# EasyEDA Pro project OV-Watch_V2.4_LCProject_2024-05-25.epro, board Back
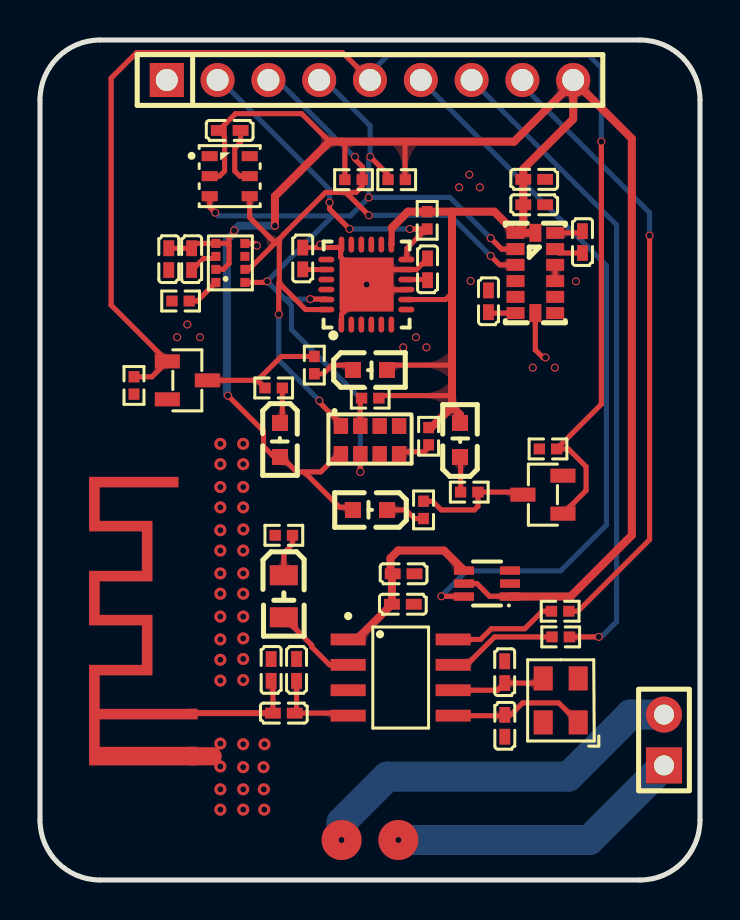
[diagram p6: board, top side]
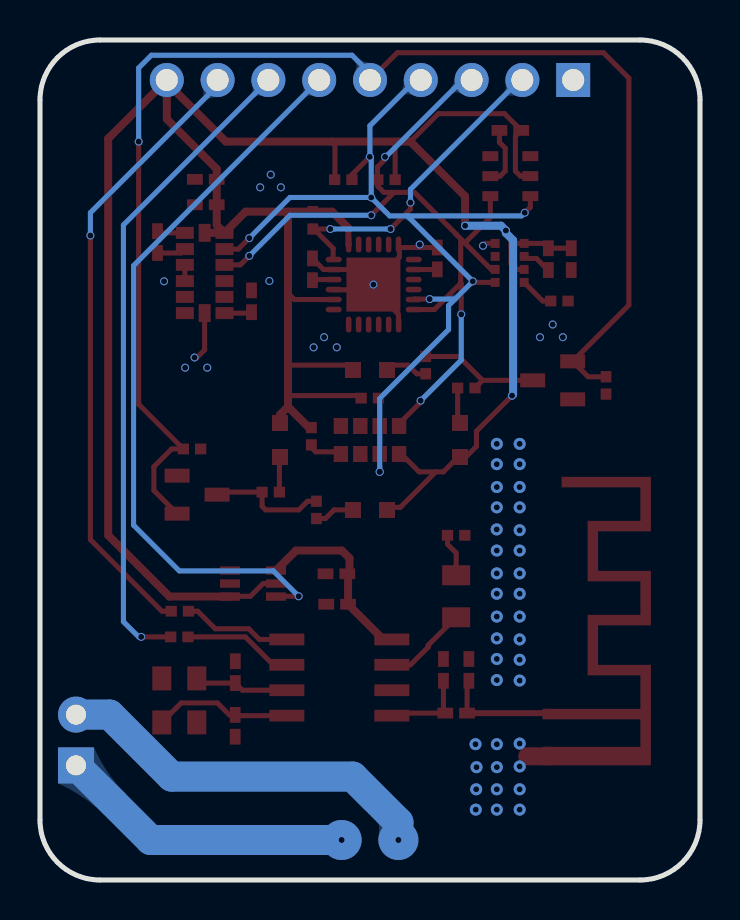
[diagram p7: board, bottom side, seen from below]

Outline 33 x 42 mm; copper layers: Top Layer, Bottom Layer. Coordinates in mm from the lower left corner of the outline.
Outline path: 0,39 0,3 arc(0.88,0.88) 3,0 30,0 arc(32.12,0.88) 33,3 33,39 arc(32.12,41.12) 30,42 3,42 arc(0.88,41.12) 0,39
Stack: Top Layer 0.035mm / Dielectric1 1.51mm FR4 er 4.5 / Bottom Layer 0.035mm

## Design rules (mm)
template: 用户自定义配置
spacing safeClearance (default): track to track 0.152, other pairs 0.152 to 0.3
track width trackWidth (default): min 0.127, default 0.254, max 2.54
differential pair differentialPair (default): width min 0.127, default 0.254, max 2.54; gap min 0.152, default 0.152
via viaSize (default): diameter min 0.4, default 0.4, max 10; hole min 0.3, default 0.3, max 6

## Placement (name value [footprint] x y rotation side)
C1  100nF  [C0402]  18.18 15.31 180 top
C2  10uF  [C0402]  18.14 13.79 180 top
C21  100nF  [C0402]  19.38 30.53 90 top
C22  2.2nF  [C0402]  13.14 31.08 90 top
C23  100nF  [C0402]  7.58 31.04 270 top
C24  100nF  [C0402]  6.44 31.04 270 top
C27  0.22uF  [C0402]  27.12 31.89 90 top
C28  4.7uF  [C0402]  22.42 28.94 270 top
C29  100nF  [C0402]  24.71 33.76 180 top
C30  10uF  [C0402]  24.71 35.03 180 top
C31  10uF  [C0402]  9.48 37.48 180 top
C37  NC  [C0402]  11.56 10.5 90 top
C39  2.7pF  [C0402]  12.19 8.34 0 top
C40  NC  [C0402]  23.24 7.71 270 top
C41  NC  [C0402]  23.23 10.39 90 top
H1  外接焊盘  [HDR-TH_2P-P2.54-V-M-1]  31.2 7 90 top
H2  -  [HDR-TH_9P-P2.54-V-M]  16.5 40 0 top
KT6328A1  -  [KT6328A-SOP8]  18.03 10.12 270 top
L1  NC  [L0402]  12.83 10.5 90 top
LED1  SZYY0805R  [LED0805-R-RD]  12.19 14.19 270 top
LED2  ORH-G36G  [LED0603-R-RD]  12 22 270 top
LED3  ORH-G36G  [LED0603-R-RD]  16.5 25.5 0 top
LED4  ORH-G36G  [LED0603-R-RD]  16.5 18.5 180 top
LED5  ORH-G36G  [LED0603-R-RD]  21 22 90 top
R1  4.7kΩ  [R0402]  15.68 35.02 180 top
R2  4.7kΩ  [R0402]  17.84 35.02 0 top
R3  10K  [R0402]  16.51 24.09 0 top
R4  4.7kΩ  [R0402]  19.36 32.98 270 top
R18  10K  [R0402]  12.19 17.23 180 top
R21  10K  [R0402]  7.03 28.95 180 top
R23  100  [R0402]  26.01 13.44 0 top
R24  100  [R0402]  26.03 12.16 0 top
R27  100  [R0402]  19.43 22.19 90 top
R28  100  [R0402]  11.68 24.6 0 top
R29  100  [R0402]  13.72 25.74 270 top
R30  100  [R0402]  19.18 18.5 270 top
R31  100  [R0402]  21.46 19.39 180 top
R32  10K  [R0402]  4.7 24.73 90 top
R33  10K  [R0402]  25.4 21.55 0 top
U1  -  [磁吸充电盘2pinX2.84]  16.5 2 0 top
U2  2N7002  [SOT-23-3_L2.9-W1.3-P1.90-LS2.4-BR]  7.37 24.98 180 top
U3  BL1551B  [SC-70-6_L2.1-W1.3-P0.65-LS2.3-BR]  22.35 14.82 0 top
U4  MPU6050-YJLTY  [QFN-24_L4.0-W4.0-P0.50-BL-EP2.7]  16.32 29.77 0 top
U5  SPL06-001  [SENSOR-SMD_SPL06-001]  9.52 30.85 90 top
U6  LSM303DLHC  [LGA-14]  24.77 30.35 270 top
U7  EM7028  [DFN-8_L4.2-W1.4-P0.95-TL]  16.5 22 0 top
U8  AHT21  [SENSOR-SMD_L3.0-W3.0-P1.00-BR]  9.48 35.19 180 top
U12  -  [通用蓝牙天线]  7.62 18.63 90 top
U13  2N7002  [SOT-23-3_L2.9-W1.3-P1.90-LS2.4-BR]  25.15 19.27 0 top
X1  24MHz  [OSC-SMD_4P-L3.2-W2.5-BL_KYOCERA_KC3225A]  26.03 8.98 90 top

## Footprints (pads in the part's own frame, mm; a bottom-side part is the same pattern mirrored in y, then rotated)
C0402
  rect 0.79x0.54 smd: 1(-0.545,0) 2(0.545,0)
DFN-8_L4.2-W1.4-P0.95-TL
  rect 0.72x0.8 smd: 1(-1.455,0.7) 2(-0.485,0.7) 3(0.485,0.7) 4(1.455,0.7) 5(1.455,-0.7) 6(0.485,-0.7) 7(-0.485,-0.7) 8(-1.455,-0.7)
HDR-TH_2P-P2.54-V-M-1
  rect 1.8x1.8 hole 1: 1(-1.27,0)
  round 1.8 hole 1: 2(1.27,0)
HDR-TH_9P-P2.54-V-M
  rect 1.7x1.7 hole 1.1: 1(-10.16,0)
  round 1.7 hole 1.1: 2(-7.62,0) 3(-5.08,0) 4(-2.54,0) 5(0,0) 6(2.54,0) 7(5.08,0) 8(7.62,0) 9(10.16,0)
KT6328A-SOP8
  rect 0.589x1.75 smd: 1(-1.905,-2.625) 2(-0.635,-2.625) 3(0.635,-2.625) 4(1.905,-2.625) 5(1.905,2.625) 6(0.635,2.625) 7(-0.635,2.625) 8(-1.905,2.625)
L0402
  rect 0.79x0.54 smd: 1(-0.545,0) 2(0.545,0)
LED0603-R-RD
  rect 0.8x0.8 smd: 1(0.851,0) 2(-0.851,0)
LED0805-R-RD
  rect 1x1.399 smd: 1(1.05,0) 2(-1.05,0)
LGA-14
  rect 0.6x0.899 smd: 1(-2.006,-0.991) 2(-1.194,-0.991) 3(-0.406,-0.991) 4(0.406,-0.991) 5(1.194,-0.991) 6(2.006,-0.991) 8(2.006,0.991) 9(1.194,0.991) 10(0.406,0.991) 11(-0.406,0.991) 12(-1.194,0.991) 13(-2.006,0.991)
  rect 0.899x0.6 smd: 7(2.006,0) 14(-2.006,0)
OSC-SMD_4P-L3.2-W2.5-BL_KYOCERA_KC3225A
  rect 1.2x0.95 smd: 1(-1.1,-0.875) 2(1.1,-0.875) 3(1.1,0.875) 4(-1.1,0.875)
QFN-24_L4.0-W4.0-P0.50-BL-EP2.7
  oval 0.28x0.8 smd: 1(-1.25,-2) 2(-0.75,-2) 3(-0.25,-2) 4(0.25,-2) 5(0.75,-2) 6(1.25,-2) 13(1.25,2) 14(0.75,2) 15(0.25,2) 16(-0.25,2) 17(-0.75,2) 18(-1.242,2)
  oval 0.8x0.28 smd: 7(2,-1.25) 8(2,-0.75) 9(2,-0.25) 10(2,0.25) 11(2,0.75) 12(2,1.25) 19(-2,1.25) 20(-2,0.75) 21(-2,0.25) 22(-2,-0.25) 23(-2,-0.75) 24(-2,-1.25)
  rect 2.7x2.7 smd: 25(0.013,0)
R0402
  rect 0.566x0.54 smd: 1(-0.433,0) 2(0.433,0)
SC-70-6_L2.1-W1.3-P0.65-LS2.3-BR
  rect 1x0.42 smd: 1(1.15,-0.65) 2(1.15,0) 3(1.15,0.65) 4(-1.15,0.65) 5(-1.15,0) 6(-1.15,-0.65)
SENSOR-SMD_L3.0-W3.0-P1.00-BR
  rect 0.8x0.5 smd: 1(1,-1) 2(1,0) 3(1,1) 4(-1,1) 5(-1,0) 6(-1,-1)
SENSOR-SMD_SPL06-001
  rect 0.45x0.45 smd: 1(0.975,-0.725) 2(0.325,-0.725) 3(-0.325,-0.725) 4(-0.975,-0.725) 5(-0.975,0.725) 6(-0.325,0.725) 7(0.325,0.725) 8(0.975,0.725)
SOT-23-3_L2.9-W1.3-P1.90-LS2.4-BR
  rect 1.25x0.7 smd: 1(1,-0.95) 2(1,0.95) 3(-1,0)
磁吸充电盘2pinX2.84
  round 2 smd: 1(-1.42,0) 2(1.42,0)
  round 2 smd far side: 1(-1.42,0) 2(1.42,0)
通用蓝牙天线
  rect 0.5x0.5 smd: 1(-10.325,0)
  rect 0.9x0.5 smd: 2(-12.425,0)

## Nets
As in the schematic.

Pads without a net: U4 2 3 4 5 6 7 14 15 16 17 19 21 22; U5 2; U6 8; U7 3 4; U8 1 6

## Via types
v1: diameter 0.6, hole 0.3, Top Layer to Bottom Layer, 36 vias
v2: diameter 0.4, hole 0.3, Top Layer to Bottom Layer, 40 vias
v3: diameter 0.5, hole 0.3, Top Layer to Bottom Layer, 2 vias

## Routing (per net, layer and track width the routed paths; a pad name or vN(x,y) marks a point on that pad's centre or on a via; arc(x,y) is an arc through that point)
3V3: length 133
  Top Layer w0.254: 13.21,20.41 14.99,18.63 15.53,18.63 ; 13.21,20.41 14.04,20.41 15.04,21.41 ; 13.21,20.41 12.83,20.41 11.94,21.3 11.94,21.21 11.65,21.21 11.18,21.68 11.18,22.44 v2(9.4,24.22) ; C24.1 C23.1 7.82,31.83 U5.8 9.34,31.83 9.45,31.71 ; U5.6 9.16,30.53 9.45,30.82 9.45,31.71 ; U3.1 23.49,14.19 22.48,14.19 21.84,14.82 U3.5 ; 20.6,25.83 20.51,25.74 17.36,25.74 ; 9.45,31.71 9.45,32.09 9.71,32.35 v2(9.71,32.47) ; U4.8 20.28,29.02 20.6,29.35 ; 20.6,24.27 20.55,24.22 16.94,24.22 ; U8.2 8.98,35.19 9.23,35.45 9.23,37.19 C31.2 9.78,38.32 13.08,38.32 14.48,36.92 ; 18.38,36.92 18.25,36.79 18.25,35.03 R2.2 ; 15.1,36.92 15.24,36.77 R1.2
  Top Layer w0.3: 17.58,32.6 17.58,31.77 U4.13
  Top Layer w0.4: 26.72,39.94 29.59,37.07 29.59,17.23 26.53,14.17 U3.1 ; 26.72,39.94 26.66,39.87 ; 26.72,39.94 H2.9 26.66,39.87 ; LED5.1 21,23.26 20.6,23.66 ; 26.66,39.87 23.71,36.92 14.48,36.92 11.75,34.19 v2(11.75,32.71) ; 26.66,39.87 26.66,38.05 24.17,35.55 C30.2 C29.2 24.17,32.75 U6.1 ; 19.43,22.62 19.56,22.62 20.6,23.66 ; 20.6,33.42 R4.1 18.4,33.42 17.58,32.6 ; 20.6,33.42 20.6,23.66 ; 20.6,33.42 22.72,33.42 U6.1 ; U6.1 U6.14
  Bottom Layer w0.4: v2(11.75,32.71) 9.95,32.71 v2(9.71,32.47) 9.71,32.35 9.34,31.99 9.34,24.27 v2(9.4,24.22)
GND: length 32.3
  Top Layer w0.254: 15.08,27.83 15.08,28.28 15.56,28.76 ; 17.14,30.53 18.32,30.52 18.82,30.52 C21.2 ; U6.11 U6.10 ; C31.1 10.03,36.88 9.74,36.59 9.74,35.45 9.99,35.19 U8.5 ; 17.13,29.51 18.32,29.51 18.33,29.52 ; v2(25.27,26.12) 25.15,26.12 24.77,26.51 U6.7 ; 15.5,30.68 15.03,31.14 15.03,31.62 C22.2 ; U5.1 10.73,31.83 v2(10.85,31.71) ; C23.2 7.6,30.5 8.18,31.08 8.69,31.08 U5.7
  Top Layer w0.9: 8.64,6.19 7.49,6.19
  Bottom Layer w1.5: v3(17.92,2) 27.47,2 H1.1
  vias: v1(9.02,21.81) v1(9.02,20.79) v1(9.02,19.65) v1(9.02,18.63) v1(9.02,17.49) v1(9.02,16.47) v1(9.02,15.33) v1(9.02,14.31) v1(9.02,13.17) v1(9.02,12.03) v1(9.02,11.01) v1(9.02,9.97) v1(9.02,6.82) v1(9.02,5.68) v1(9.02,4.53) v1(9.02,3.52) v1(10.16,21.81) v1(10.16,20.79) v1(10.16,19.65) v1(10.16,18.63) v1(10.17,17.53) v1(10.16,16.47) v1(10.16,15.33) v1(10.16,14.31) v1(10.16,13.17) v1(10.16,12.08) v1(10.16,11.05) v1(10.16,10) v1(10.16,6.79) v1(10.16,5.64) v1(10.16,4.53) v1(10.16,3.52) v1(11.22,6.79) v1(11.18,5.64) v1(11.19,4.53) v1(11.21,3.52) v2(6.86,27.14) v2(7.37,27.78) v2(8,27.14) v2(14.01,31.77) v2(16.33,29.77) v2(18.16,26.63) v2(18.8,27.14) v2(19.32,26.63) v2(20.96,34.63) v2(21.46,35.27) v2(21.53,29.95) v2(21.99,34.63) v2(24.64,25.62) v2(25.74,25.62) v2(26.8,29.94)
AHT_SCL: length 46.5
  Top Layer w0.254: U6.2 23.08,31.54 v2(22.53,32.09) ; U4.23 14.29,29.05 v2(13.52,29.05) ; v2(16.51,36.16) 17.4,35.27 R2.1 ; 16.01,21.41 v2(16.01,20.41) ; U8.3 8.48,33.64 v2(8.76,33.36) ; v2(11.36,29.94) 11.3,29.88 U5.4
  Bottom Layer w0.254: 14.63,33.21 v2(11.36,29.94) 12.25,29.05 ; 14.63,33.21 15.52,33.21 v2(16.44,34.13) ; 14.63,33.21 8.92,33.21 v2(8.76,33.36) ; 12.25,29.05 12.57,28.72 12.57,27.52 16.01,24.08 v2(16.01,20.41) ; 12.25,29.05 v2(13.52,29.05) ; 16.44,36.14 16.5,36.21 16.5,37.71 14.21,40 H2.4 ; 16.44,36.14 v2(16.44,34.13) ; 16.44,36.14 16.5,36.14 v2(16.51,36.16) ; v2(16.44,34.13) 20.5,34.13 v2(22.53,32.09)
AHT_SDA: length 41.4
  Top Layer w0.254: v2(11.94,28.28) 11.94,29.81 11.96,29.84 ; U8.4 10.48,33.12 11.76,31.85 ; U6.3 22.98,30.76 v2(22.53,31.2) ; v2(15.75,36.16) 15.75,36.03 16.13,35.65 16.13,35.03 R1.1 16.11,34.69 15.8,34.38 15.29,34.38 ; 15.29,34.38 v2(16.44,33.24) ; 15.29,34.38 14.28,34.38 12.19,32.29 12.19,32.28 11.96,32.06 ; 11.96,32.06 11.96,29.84 ; 11.96,32.06 11.76,31.85 ; 15.04,22.81 13.97,23.89 v2(13.97,23.97) ; 11.96,29.84 13.28,28.52 U4.24 ; 11.76,31.85 10.44,30.53 U5.3
  Bottom Layer w0.254: v2(13.97,23.97) 11.94,26 v2(11.94,28.28) ; v2(15.75,36.16) 15.71,36.16 11.87,40 H2.3 ; v2(22.53,31.2) 20.5,33.24 v2(16.44,33.24)
BLE_EN: length 37
  Top Layer w0.254: U3.6 21.19,14.19 v2(20.07,14.19)
  Bottom Layer w0.254: H2.6 28.32,30.72 28.32,17.74 26.03,15.46 21.34,15.46 v2(20.07,14.19)
BLE_RX: length 32.8
  Top Layer w0.254: v2(27.94,12.16) R24.2
  Bottom Layer w0.254: v2(27.94,12.16) 28.07,12.16 28.83,12.92 28.83,32.75 H2.7
BLE_TX: length 31.1
  Top Layer w0.254: R23.2 26.9,13.44 30.48,17.02 v2(30.48,32.22)
  Bottom Layer w0.254: H2.8 24.12,39.72 30.48,33.36 v2(30.48,32.22)
CPOUT: length 1.2
  Top Layer w0.254: U4.20 13.15,30.52 C22.1
EM7028_INT: length 1.4
  Top Layer w0.254: 16.08,24.22 16.01,24.16 16.01,22.81
KT_LED: length 4.3
  Top Layer w0.254: LED1.1 13.59,11.74 13.59,11.65 14.48,10.76 KT6328A1.2
LED_EN: length 68.5
  Top Layer w0.254: v2(28.07,36.92) 28.07,23.79 R33.2 26.42,21.55 27.31,20.66 27.31,19.48 U13.1 ; H2.5 15.13,41.36 4.83,41.36 3.56,40.09 3.56,28.74 U2.1 5.59,25.16 R32.2
  Bottom Layer w0.254: v2(28.07,36.92) 28.07,40.6 27.43,41.24 17.4,41.24 16.5,40.34 H2.5
MPU6050_INT: length 16.1
  Top Layer w0.254: 19.31,32.55 18.34,31.59 18.34,31.05 U4.12 ; 19.31,32.55 v2(18.49,32.55) ; 19.31,32.55 R4.2 ; v2(15.47,32.55) 14.48,33.55 v2(14.48,33.87)
  Bottom Layer w0.254: v2(18.49,32.55) v2(15.47,32.55) ; v2(14.48,33.87) 14.48,34.53 9.01,40 H2.2
OSCI: length 6.9
  Top Layer w0.254: X1.1 25.94,8.85 24.13,8.85 23.53,8.25 C40.1 23.2,8.22 KT6328A1.5
OSCO: length 4.7
  Top Layer w0.254: X1.3 24.93,9.85 C41.1 22.88,9.49 KT6328A1.6
REGOUT: length 1.1
  Top Layer w0.254: 19.38,29.99 19.34,30.02 U4.10
$1N5774: length 1.7
  Top Layer w0.254: U5.5 7.86,28.95 R21.1
$1N5779: length 1.4
  Top Layer w0.254: U6.6 22.47,28.34 C28.2
$1N5781: length 1.4
  Top Layer w0.254: C27.2 27.04,32.36 U6.13
$1N5782: length 1.4
  Top Layer w0.254: C27.1 25.95,31.35 U6.12
$1N24406: length 1.7
  Top Layer w0.254: R27.1 19.43,21.63 19.21,21.41 17.96,21.41
$1N24460: length 1.8
  Top Layer w0.254: 11.94,22.91 12.12,23.09 R28.2
$1N24534: length 2.1
  Top Layer w0.254: 15.66,25.74 14.6,25.74 14.16,25.31 R29.2
$1N24609: length 2.2
  Top Layer w0.254: 17.23,18.63 17.36,18.5 18.3,18.5 18.73,18.07 R30.2
$1N24611: length 6
  Top Layer w0.254: R30.1 19.62,18.94 20.06,18.5 21.72,18.5 21.9,18.68 R31.1 24.02,19.39 U13.3
$1N24684: length 1.8
  Top Layer w0.254: LED5.2 21.03,21.12 R31.2
$1N24861: length 6.4
  Top Layer w0.254: 10.87,24.98 R28.1 ; 10.87,24.98 12.06,26.18 R29.1 ; 10.87,24.98 U2.3
$2N277: length 19.2
  Bottom Layer w1.5: v3(15.08,2) 15.08,2.89 17.36,5.17 26.42,5.17 29.52,8.27 H1.2
$3N536: length 9.5
  Top Layer w0.4: U3.4 20.2,16.47 17.91,16.47 17.53,16.09 17.53,15.42 C1.2 17.6,15.27 C2.2 15.84,12.03 KT6328A1.1
$3N3362: length 5.8
  Top Layer w0.254: C39.1 11.65,9.87 C37.1
  Top Layer w0.3: C39.1 7.49,8.34
$3N3704: length 5.5
  Top Layer w0.254: R23.1 25.12,13.44 24.24,12.56 22.56,12.56 22.03,12.03 KT6328A1.8
$3N3732: length 5.5
  Top Layer w0.254: R24.1 22.73,12.16 21.34,10.76 KT6328A1.7
$3N3781: length 2.2
  Top Layer w0.254: R18.1 12.62,16.79 12.19,16.35 LED1.2
$3N4660: length 4.4
  Top Layer w0.254: L1.1 12.83,8.44 C39.2 15.28,8.34 KT6328A1.4

## Copper pours and planes (outline as drawn; the poured copper is in the pictures)
GND on Top Layer: -2.03,45.81 35.56,45.81 35.56,-2.96 -2.03,-2.96
GND on Bottom Layer: -2.29,44.92 36.83,44.92 36.83,-4.36 -2.29,-4.36

Small or netless copper shapes (teardrops, artwork), in the pictures only: 129 on Top Layer, 36 on Bottom Layer
